# Altium project Gas_Sampler.PrjPcb (part 1 of 3)
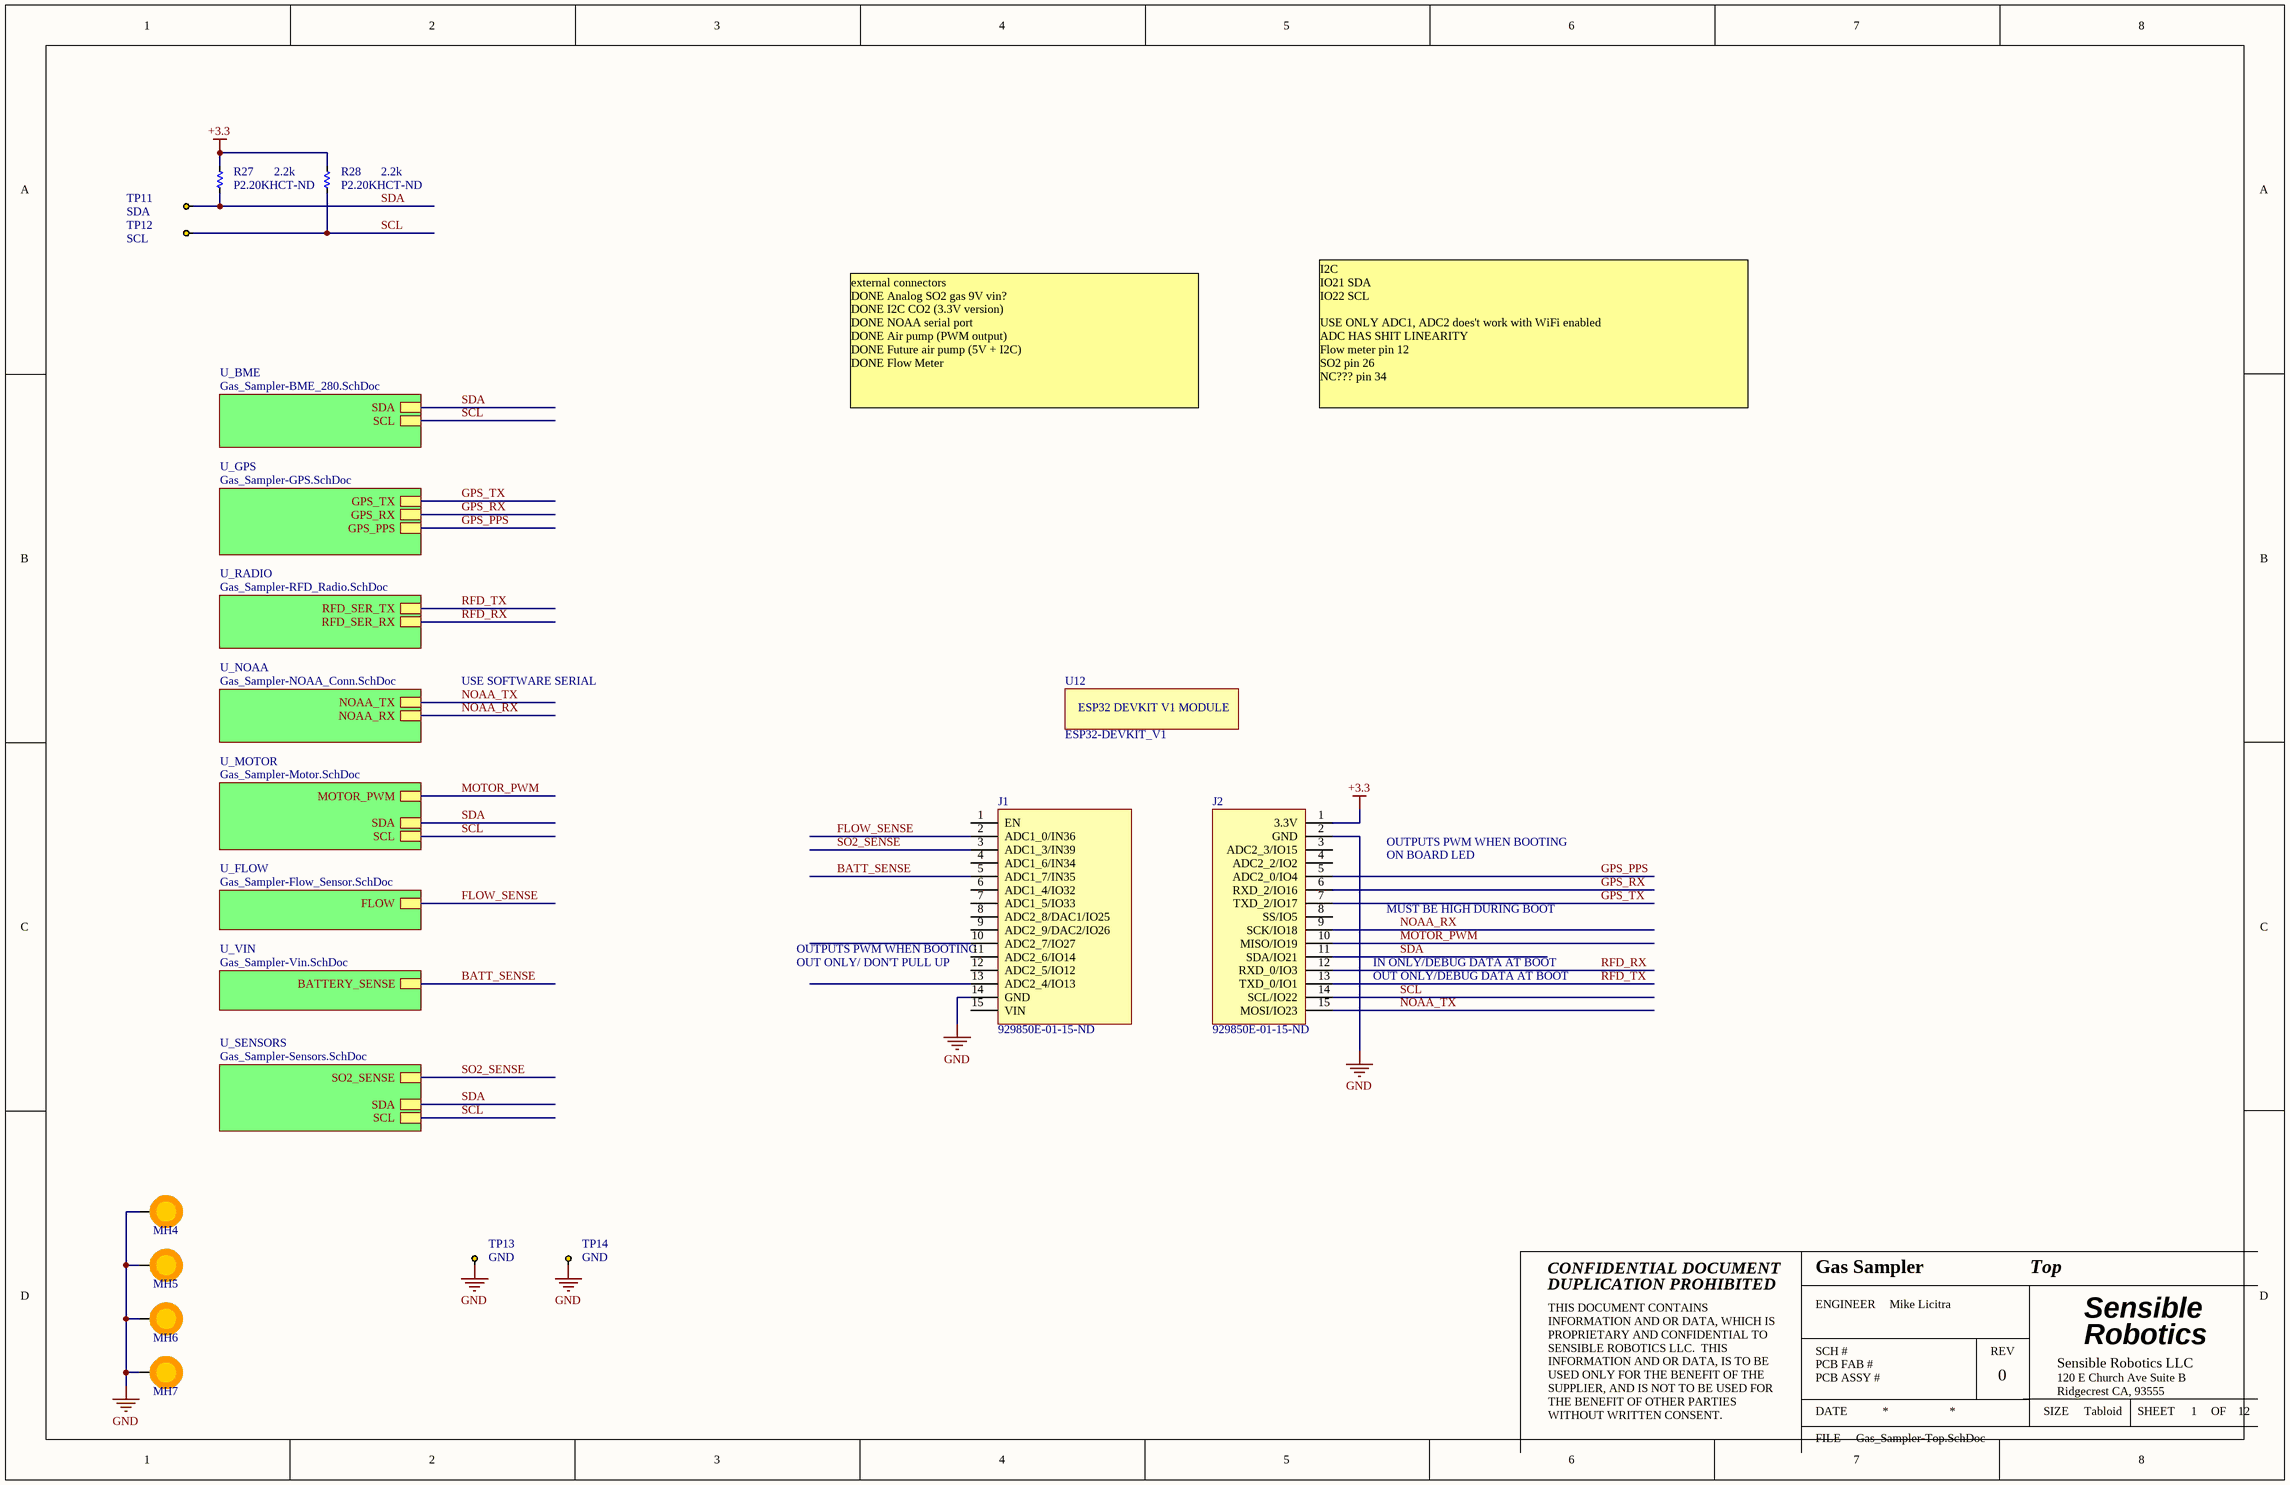
[diagram p0: Gas_Sampler-Top.SchDoc]
PCBRevision: 0; PCBName: Gas Sampler
12 sheets, 130 parts. Net scope: hierarchical (ports join the sheet entries above them; power ports are global).
Board file: Gas_Sampler-PCB.PcbDoc
Sheets:
  Gas_Sampler-Top.SchDoc
    U_RADIO = Gas_Sampler-RFD_Radio.SchDoc
    U_BME = Gas_Sampler-BME_280.SchDoc
    U_GPS = Gas_Sampler-GPS.SchDoc
    U_NOAA = Gas_Sampler-NOAA_Conn.SchDoc
    U_MOTOR = Gas_Sampler-Motor.SchDoc
    U_FLOW = Gas_Sampler-Flow_Sensor.SchDoc
    U_VIN = Gas_Sampler-Vin.SchDoc
      U_5V = Gas_Sampler-5V_Buck.SchDoc
      U_3V = Gas_Sampler-3.3V_LDO.SchDoc
    U_SENSORS = Gas_Sampler-Sensors.SchDoc
      U-9VBOOST = Gas_Sampler-9V_Boost.SchDoc

## Sheet Gas_Sampler-Top.SchDoc: Top
size Tabloid; Organization: Sensible Robotics LLC; Address1: 120 E Church Ave Suite B; Address2: Ridgecrest CA, 93555; Revision: 0; SheetNumber: 1; SheetTotal: 12; ApprovedBy: Approved Name; Engineer: Mike Licitra; PageSetup: Record=PageOptions|CenterHorizontal=True|CenterVertical=True|PrintScale=0.98|XCorrection=1.00|YCorrection=1.00|PrintKind=0|BorderSize=5000000|LeftOffset=0|BottomOffset=0|Orientation=2|PaperLength=1000|PaperWidth=1000|Scale=100|PaperSource=15|PrintQuality=600|MediaType=1|DitherType=10|PaperKind=Tabloid|PrintScaleMode=1

### Parts
J1  Supplier Part Number 1: 929850E-01-15-ND  [SOCKET_1X15_POS_0.1_INCH]  (hidden comment: ESP32-DEVKIT_V1-30PIN_MODULE_J2)
J2  Supplier Part Number 1: 929850E-01-15-ND  [SOCKET_1X15_POS_0.1_INCH]  (hidden comment: ESP32-DEVKIT_V1-30PIN_MODULE_J3)
MH4  SCREW  [SCREW_M3]  (value not drawn)  (no BOM)
MH5  SCREW  [SCREW_M3]  (value not drawn)  (no BOM)
MH6  SCREW  [SCREW_M3]  (value not drawn)  (no BOM)
MH7  SCREW  [SCREW_M3]  (value not drawn)  (no BOM)
R27  value 2.2k  Supplier Part Number 1: P2.20KHCT-ND  [R0603]  (hidden comment: RES_0603_2.2K_OHM_1/10W_1%)
R28  value 2.2k  Supplier Part Number 1: P2.20KHCT-ND  [R0603]  (hidden comment: RES_0603_2.2K_OHM_1/10W_1%)
TP11  SDA  [TP_KEYSTONE_5001]
TP12  SCL  [TP_KEYSTONE_5001]
TP13  GND  [TP_KEYSTONE_5001]
TP14  GND  [TP_KEYSTONE_5001]
U12  ESP32-DEVKIT_V1  [ESP32_DEVKITV1_MODULE]

### Sub-sheets
U_BME = Gas_Sampler-BME_280.SchDoc: SDA, SCL
U_FLOW = Gas_Sampler-Flow_Sensor.SchDoc: FLOW
U_GPS = Gas_Sampler-GPS.SchDoc: GPS_PPS, GPS_TX, GPS_RX
U_MOTOR = Gas_Sampler-Motor.SchDoc: MOTOR_PWM, SDA, SCL
U_NOAA = Gas_Sampler-NOAA_Conn.SchDoc: NOAA_RX, NOAA_TX
U_RADIO = Gas_Sampler-RFD_Radio.SchDoc: RFD_SER_TX, RFD_SER_RX
U_SENSORS = Gas_Sampler-Sensors.SchDoc: SDA, SCL, SO2_SENSE
U_VIN = Gas_Sampler-Vin.SchDoc: BATTERY_SENSE

### Nets
+3.3: J2.1(3.3V) R27.2 R28.2
GND: J1.14(GND) J2.2(GND) MH4.1 MH5.1 MH6.1 MH7.1 TP13.1 TP14.1
BATT_SENSE: J1.5(ADC1_7/IN35) ; sheet U_VIN/BATTERY_SENSE
FLOW_SENSE: J1.2(ADC1_0/IN36) ; sheet U_FLOW/FLOW
GPS_PPS: J2.5(ADC2_0/IO4) ; sheet U_GPS/GPS_PPS
GPS_RX: J2.6(RXD_2/IO16) ; sheet U_GPS/GPS_RX
GPS_TX: J2.7(TXD_2/IO17) ; sheet U_GPS/GPS_TX
MOTOR_PWM: J2.10(MISO/IO19) ; sheet U_MOTOR/MOTOR_PWM
NOAA_RX: J2.9(SCK/IO18) ; sheet U_NOAA/NOAA_RX
NOAA_TX: J2.15(MOSI/IO23) ; sheet U_NOAA/NOAA_TX
RFD_RX: J2.12(RXD_0/IO3) ; sheet U_RADIO/RFD_SER_RX
RFD_TX: J2.13(TXD_0/IO1) ; sheet U_RADIO/RFD_SER_TX
SCL: J2.14(SCL/IO22) R28.1 TP12.1 ; sheet U_BME/SCL, sheet U_MOTOR/SCL, sheet U_SENSORS/SCL
SDA: J2.11(SDA/IO21) R27.1 TP11.1 ; sheet U_BME/SDA, sheet U_MOTOR/SDA, sheet U_SENSORS/SDA
SO2_SENSE: J1.3(ADC1_3/IN39) ; sheet U_SENSORS/SO2_SENSE

Not connected (* = marked no-connect by the designer): J1 1(EN) 4(ADC1_6/IN34) 6(ADC1_4/IO32) 7(ADC1_5/IO33) 8(ADC2_8/DAC1/IO25) 9(ADC2_9/DAC2/IO26) 10(ADC2_7/IO27) 11(ADC2_6/IO14) 12(ADC2_5/IO12) 13(ADC2_4/IO13) 15(VIN); J2 3(ADC2_3/IO15) 4(ADC2_2/IO2) 8(SS/IO5)

### Notes on the sheet
- external connectors
  DONE Analog SO2 gas 9V vin?
  DONE I2C CO2 (3.3V version)
  DONE NOAA serial port
  DONE Air pump (PWM output)
  DONE Future air pump (5V + I2C)
  DONE Flow Meter
- I2C
  IO21 SDA
  IO22 SCL
  USE ONLY ADC1, ADC2 does't work with WiFi enabled
  ADC HAS SHIT LINEARITY
  Flow meter pin 12
  SO2 pin 26
  NC??? pin 34
- USE SOFTWARE SERIAL
- ON BOARD LED
- OUTPUTS PWM WHEN BOOTING
- OUT ONLY/ DON'T PULL UP
- IN ONLY/DEBUG DATA AT BOOT
- MUST BE HIGH DURING BOOT
- OUT ONLY/DEBUG DATA AT BOOT
- CONFIDENTIAL DOCUMENT
- DUPLICATION PROHIBITED
- ENGINEER
- PCB FAB #
- SCH #
- REV
- Sensible
- Robotics
- THIS DOCUMENT CONTAINS INFORMATION AND OR DATA, WHICH IS PROPRIETARY AND CONFIDENTIAL TO SENSIBLE ROBOTICS LLC.  THIS INFORMATION AND OR DATA, IS TO BE USED ONLY FOR THE BENEFIT OF THE SUPPLIER, AND IS NOT TO BE USED FOR THE BENEFIT OF OTHER PARTIES WITHOUT WRITTEN CONSENT.
- DATE
- PCB ASSY #
- SIZE
- Tabloid
- SHEET
- OF
- FILE
- (in symbol ESP32-DEVKIT_V1) ESP32 DEVKIT V1 MODULE

### Library data of the parts
J1 = ESP32-DEVKIT_V1-30PIN_MODULE_J2: CONN_SOCKETS_1X15_POS_0.1_INCH; Manufacturer: 3M; Manufacturer Part Number: 929850-01-15-RA; Connector Type: Receptacle; Number of Positions: 19; Number of Positions Loaded: All; Pitch: 0.100" (2.54mm); Supplier 1: Digi-Key; Packaging: Bulk; Contact Type: Forked; Number of Rows: 1; Mounting Type: Through Hole; Termination: Solder; Contact Finish: Gold; Contact Finish Thickness: 10µin (0.25µm); ComponentLink1URL: http://multimedia.3m.com/mws/mediawebserver?66666UuZjcFSLXTt4Xf_LXs6EVuQEcuZgVs6EVs6E666666--; ComponentLink1Description: http://multimedia.3m.com/mws/mediawebserver?66666UuZjcFSLXTt4Xf_LXs6EVuQEcuZgVs6EVs6E666666--
J2 = ESP32-DEVKIT_V1-30PIN_MODULE_J3: CONN_SOCKETS_1X15_POS_0.1_INCH; Manufacturer: 3M; Manufacturer Part Number: 929850-01-15-RA; Connector Type: Receptacle; Number of Positions: 19; Number of Positions Loaded: All; Pitch: 0.100" (2.54mm); Supplier 1: Digi-Key; Packaging: Bulk; Contact Type: Forked; Number of Rows: 1; Mounting Type: Through Hole; Termination: Solder; Contact Finish: Gold; Contact Finish Thickness: 10µin (0.25µm); ComponentLink1URL: http://multimedia.3m.com/mws/mediawebserver?66666UuZjcFSLXTt4Xf_LXs6EVuQEcuZgVs6EVs6E666666--; ComponentLink1Description: http://multimedia.3m.com/mws/mediawebserver?66666UuZjcFSLXTt4Xf_LXs6EVuQEcuZgVs6EVs6E666666--
R27 R28 = RES_0603_2.2K_OHM_1/10W_1%: RES 2.2K OHM 1/10W 1% 0603 SMD; Manufacturer: Panasonic Electronic Components; Manufacturer Part Number: ERJ-3EKF2201V; Part Number: 470-00097-00; Power (Watts): 0.1W, 1/10W; Temperature Coefficient: ±100ppm/°C; Supplier 1: Digi-Key; RoHS: RoHS Compliant; Category: Resistors; Stock 1: 242061; Pricing 1: 1=0.1, 50=0.0138, 100=0.0105, 250=0.0078, 500=0.00576, 1000=0.00384 (USD); Packaging: Cut Tape (CT); Composition: Thick Film; Features: -; Tolerance: ±1%; Package / Case: 0603 (1608 Metric); Supplier Device Package: 0603; Size / Dimension: 0.063" L x 0.031" W (1.60mm x 0.80mm); Height: 0.022" (0.55mm); Number of Terminations: 2; ComponentLink1URL: http://industrial.panasonic.com/www-cgi/jvcr13pz.cgi?E+PZ+3+AOA0002+ERJ3EKF2201V+7+WW; ComponentLink1Description: http://industrial.panasonic.com/www-cgi/jvcr13pz.cgi?E+PZ+3+AOA0002+ERJ3EKF2201V+7+WW
TP11-TP14 = TEST_KEYSTONE5001: PC TEST POINT TH RING; Manufacturer: Keystone Electronics; Manufacturer Part Number: 5001; Part Number: 250-00184-00; Supplier 1: Digi-Key; Supplier Part Number 1: 5001K-ND; RoHS: RoHS Compliant; Category: Test and Measurement; Stock 1: 341830; Pricing 1: 1=0.33, 10=0.309, 50=0.2252, 100=0.2164, 250=0.19432, 500=0.18548, 1000=0.15456, 2500=0.14131, 5000=0.13248 (USD); Packaging: Bulk; Type: PC Test Point, Miniature; Terminal: 0.010" x 0.020" (0.25mm x 0.51mm) Phosphor Bronze Wire, Silver Plate; Mounting Type: 0.040" (1.02mm) Hole Diameter; Material: Base, Nylon 46, UL 94V-0; Color: Black; ComponentLink1URL: http://www.keyelco.com/product-pdf.cfm?p=1310; ComponentLink1Description: http://www.keyelco.com/product-pdf.cfm?p=1310
U12 = ESP32-DEVKIT_V1: ESP32-DEVKIT V1 MODULE; Supplier 1: Digi-Key

## Sheet Gas_Sampler-RFD_Radio.SchDoc: Radio
size Tabloid; Organization: Sensible Robotics LLC; Address1: 120 E Church Ave Suite B; Address2: Ridgecrest CA, 93555; Revision: 0; SheetNumber: 2; SheetTotal: 12; ApprovedBy: Approved Name; Engineer: Mike Licitra; PageSetup: Record=PageOptions|CenterHorizontal=True|CenterVertical=True|PrintScale=0.98|XCorrection=1.00|YCorrection=1.00|PrintKind=0|BorderSize=5000000|LeftOffset=0|BottomOffset=0|Orientation=2|PaperLength=1000|PaperWidth=1000|Scale=100|PaperSource=15|PrintQuality=600|MediaType=1|DitherType=10|PaperKind=Tabloid|PrintScaleMode=1
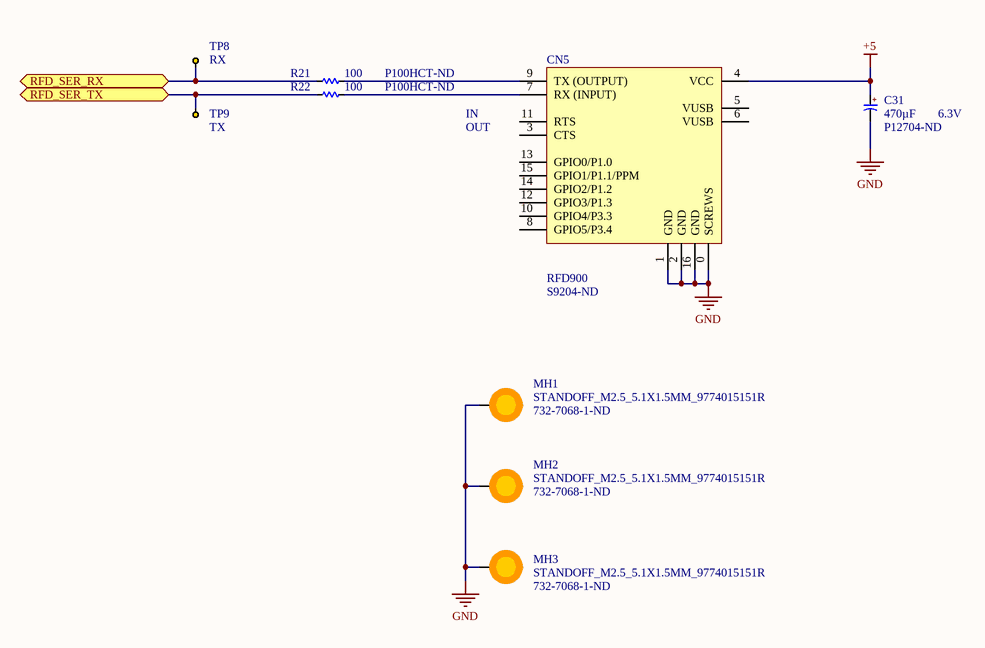
[diagram p1: Gas_Sampler-RFD_Radio.SchDoc]

### Parts
C31  value 470µF  Voltage - Rated: 6.3V  Supplier Part Number 1: P12704-ND  [CAP_RADIAL_8MM_DIA_11.5MM_LEN_3.5MM_LEADSPACE]  (hidden comment: CAP_ALUM_470UF_6.3V_20%_RADIAL_8X11.5MM)
CN5  RFD900  Supplier Part Number 1: S9204-ND  [RFD900_FLAT]
MH1  STANDOFF_M2.5_5.1X1.5MM_9774015151R  Supplier Part Number 1: 732-7068-1-ND  [STANDOFF_M2.5_5.1X1.5MM]
MH2  STANDOFF_M2.5_5.1X1.5MM_9774015151R  Supplier Part Number 1: 732-7068-1-ND  [STANDOFF_M2.5_5.1X1.5MM]
MH3  STANDOFF_M2.5_5.1X1.5MM_9774015151R  Supplier Part Number 1: 732-7068-1-ND  [STANDOFF_M2.5_5.1X1.5MM]
R21  value 100  Supplier Part Number 1: P100HCT-ND  [R0603]  (hidden comment: RES_0603_100_OHM_1/10W_1%)
R22  value 100  Supplier Part Number 1: P100HCT-ND  [R0603]  (hidden comment: RES_0603_100_OHM_1/10W_1%)
TP8  RX  [TP_KEYSTONE_5001]
TP9  TX  [TP_KEYSTONE_5001]

### Ports
RFD_SER_RX, RFD_SER_TX

### Nets
+5: C31.1 CN5.4(VCC)
GND: C31.2 CN5.0(SCREWS) CN5.1(GND) CN5.2(GND) CN5.16(GND) MH1.1 MH2.1 MH3.1
RFD_RX: R21.1 TP8.1 ; port RFD_SER_RX
RFD_TX: R22.1 TP9.1 ; port RFD_SER_TX
NetCN5_7: CN5.7(RX_(INPUT)) R22.2
NetCN5_9: CN5.9(TX_(OUTPUT)) R21.2

Not connected (* = marked no-connect by the designer): CN5 3(CTS) 5(VUSB) 6(VUSB) 8(GPIO5/P3.4) 10(GPIO4/P3.3) 11(RTS) 12(GPIO3/P1.3) 13(GPIO0/P1.0) 14(GPIO2/P1.2) 15(GPIO1/P1.1/PPM)

### Notes on the sheet
- IN
- OUT
- CONFIDENTIAL DOCUMENT
- DUPLICATION PROHIBITED
- ENGINEER
- PCB FAB #
- SCH #
- REV
- Sensible
- Robotics
- THIS DOCUMENT CONTAINS INFORMATION AND OR DATA, WHICH IS PROPRIETARY AND CONFIDENTIAL TO SENSIBLE ROBOTICS LLC.  THIS INFORMATION AND OR DATA, IS TO BE USED ONLY FOR THE BENEFIT OF THE SUPPLIER, AND IS NOT TO BE USED FOR THE BENEFIT OF OTHER PARTIES WITHOUT WRITTEN CONSENT.
- DATE
- PCB ASSY #
- SIZE
- Tabloid
- SHEET
- OF
- FILE
- (in symbol CAP_ALUM_470UF_6.3V_20%_RADIAL_8X11.5MM) +

### Library data of the parts
C31 = CAP_ALUM_470UF_6.3V_20%_RADIAL_8X11.5MM: CAP ALUM 470UF 6.3V 20% RADIAL; Manufacturer: Panasonic Electronic Components; Manufacturer Part Number: EEU-FC0J471; Lifetime @ Temp.: 2000 Hrs @ 105°C; Ripple Current: 555mA; Impedance: 117 mOhm; Supplier 1: Digi-Key; RoHS: RoHS Compliant; Category: Capacitors; Stock 1: 89301; Pricing 1: 1=0.48, 50=0.2352, 100=0.2016, 500=0.1512, 1000=0.12768, 5000=0.11424, 10000=0.10752, 25000=0.1008 (USD); Packaging: Bulk; Tolerance: ±20%; Operating Temperature: -55°C ~ 105°C; Features: General Purpose; ESR (Equivalent Series Resistance): -; Mounting Type: Through Hole; Package / Case: Radial, Can; Size / Dimension: 0.315" Dia (8.00mm); Height - Seated (Max): 0.453" (11.50mm); Lead Spacing: 0.138" (3.50mm); ComponentLink1URL: http://industrial.panasonic.com/www-cgi/jvcr13pz.cgi?E+PZ+3+ABA0022+EEUFC0J471+7+WW; ComponentLink1Description: http://industrial.panasonic.com/www-cgi/jvcr13pz.cgi?E+PZ+3+ABA0022+EEUFC0J471+7+WW
CN5 = RFD900: Manufacturer Part Number: SFH11-PBPC-D08-RA-BK; Manufacturer: Sullins Connector Solutions; Supplier 1: Digikey
MH1-MH3 = STANDOFF_M2.5_5.1X1.5MM_9774015151R: RND STNDFF M2.5X0.45 STEEL 1.5MM; Manufacturer: Wurth Electronics Inc.; Manufacturer Part Number: 9774015151R; Supplier 1: Digikey
R21 R22 = RES_0603_100_OHM_1/10W_1%: RES 100 OHM 1/10W 1% 0603 SMD; Manufacturer: Panasonic Electronic Components; Manufacturer Part Number: ERJ-3EKF1000V; Part Number: 470-00121-00; Power (Watts): 0.1W, 1/10W; Temperature Coefficient: ±100ppm/°C; Supplier 1: Digi-Key; RoHS: RoHS Compliant; Category: Resistors; Stock 1: 1025169; Pricing 1: 1=0.1, 50=0.0138, 100=0.0105, 250=0.0078, 500=0.00576, 1000=0.00384 (USD); Packaging: Cut Tape (CT); Composition: Thick Film; Features: -; Tolerance: ±1%; Package / Case: 0603 (1608 Metric); Supplier Device Package: 0603; Size / Dimension: 0.063" L x 0.031" W (1.60mm x 0.80mm); Height: 0.022" (0.55mm); Number of Terminations: 2; ComponentLink1URL: http://industrial.panasonic.com/www-cgi/jvcr13pz.cgi?E+PZ+3+AOA0002+ERJ3EKF1000V+7+WW; ComponentLink1Description: http://industrial.panasonic.com/www-cgi/jvcr13pz.cgi?E+PZ+3+AOA0002+ERJ3EKF1000V+7+WW
TP8 TP9 = TEST_KEYSTONE5001: as TP11 on sheet Gas_Sampler-Top; Supplier 1: Digi-Key; Supplier Part Number 1: 5001K-ND; RoHS: RoHS Compliant; Category: Test and Measurement; Stock 1: 341830; Pricing 1: 1=0.33, 10=0.309, 50=0.2252, 100=0.2164, 250=0.19432, 500=0.18548, 1000=0.15456, 2500=0.14131, 5000=0.13248 (USD); Packaging: Bulk; Type: PC Test Point, Miniature; Terminal: 0.010" x 0.020" (0.25mm x 0.51mm) Phosphor Bronze Wire, Silver Plate; Mounting Type: 0.040" (1.02mm) Hole Diameter; Material: Base, Nylon 46, UL 94V-0; Color: Black; ComponentLink1URL: http://www.keyelco.com/product-pdf.cfm?p=1310; ComponentLink1Description: http://www.keyelco.com/product-pdf.cfm?p=1310

## Sheet Gas_Sampler-BME_280.SchDoc: BME 280
size Tabloid; Organization: Sensible Robotics LLC; Address1: 120 E Church Ave Suite B; Address2: Ridgecrest CA, 93555; Revision: 0; SheetNumber: 7; SheetTotal: 12; ApprovedBy: Approved Name; Engineer: Mike Licitra; PageSetup: Record=PageOptions|CenterHorizontal=True|CenterVertical=True|PrintScale=0.98|XCorrection=1.00|YCorrection=1.00|PrintKind=0|BorderSize=5000000|LeftOffset=0|BottomOffset=0|Orientation=2|PaperLength=1000|PaperWidth=1000|Scale=100|PaperSource=15|PrintQuality=600|MediaType=1|DitherType=10|PaperKind=Tabloid|PrintScaleMode=1
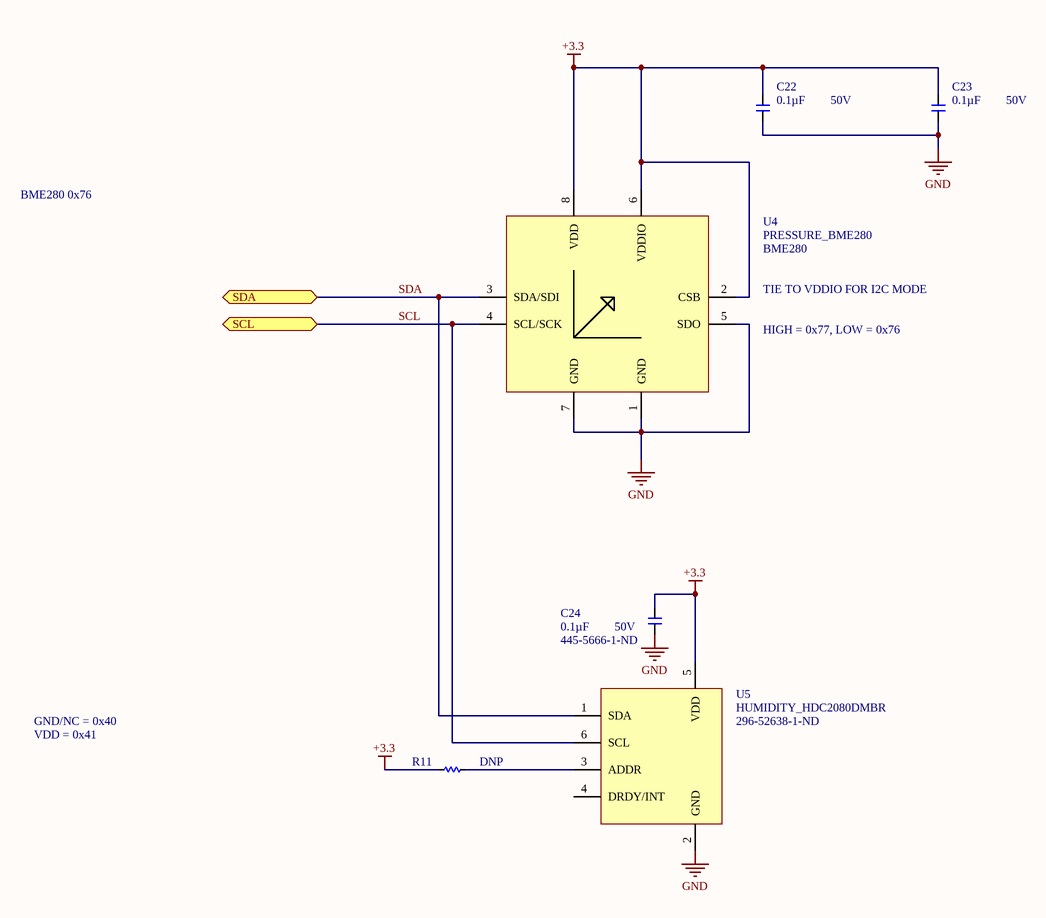
[diagram p2: Gas_Sampler-BME_280.SchDoc]

### Parts
C22  value 0.1µF  Voltage - Rated: 50V  [C0603]  (hidden comment: CAP_CER_0603_0.1UF_50V_10%_X7R)
C23  value 0.1µF  Voltage - Rated: 50V  [C0603]  (hidden comment: CAP_CER_0603_0.1UF_50V_10%_X7R)
C24  value 0.1µF  Voltage - Rated: 50V  Supplier Part Number 1: 445-5666-1-ND  [C0603]  (hidden comment: CAP_CER_0603_0.1UF_50V_10%_X7R)
R11  value DNP  [R0603]  (hidden comment: RES_0603_DNP)  (no BOM)
U4  PRESSURE_BME280  Manufacturer Part Number: BME280  [BOSCH_BME280]
U5  HUMIDITY_HDC2080DMBR  Supplier Part Number 1: 296-52638-1-ND  [6DFN3X3_NO_EP]

### Ports
SCL, SDA

### Nets
+3.3: C22.1 C23.1 C24.1 R11.1 U4.2(CSB) U4.6(VDDIO) U4.8(VDD) U5.5(VDD)
GND: C22.2 C23.2 C24.2 U4.1(GND) U4.5(SDO) U4.7(GND) U5.2(GND)
SCL: U4.4(SCL/SCK) U5.6(SCL) ; port SCL
SDA: U4.3(SDA/SDI) U5.1(SDA) ; port SDA
NetR11_2: R11.2 U5.3(ADDR)

Not connected (* = marked no-connect by the designer): U5 4(DRDY/INT)

### Notes on the sheet
- BME280 0x76
- TIE TO VDDIO FOR I2C MODE
- HIGH = 0x77, LOW = 0x76
- GND/NC = 0x40
- VDD = 0x41
- CONFIDENTIAL DOCUMENT
- DUPLICATION PROHIBITED
- ENGINEER
- PCB FAB #
- SCH #
- REV
- Sensible
- Robotics
- THIS DOCUMENT CONTAINS INFORMATION AND OR DATA, WHICH IS PROPRIETARY AND CONFIDENTIAL TO SENSIBLE ROBOTICS LLC.  THIS INFORMATION AND OR DATA, IS TO BE USED ONLY FOR THE BENEFIT OF THE SUPPLIER, AND IS NOT TO BE USED FOR THE BENEFIT OF OTHER PARTIES WITHOUT WRITTEN CONSENT.
- DATE
- PCB ASSY #
- SIZE
- Tabloid
- SHEET
- OF
- FILE

### Library data of the parts
C22-C24 = CAP_CER_0603_0.1UF_50V_10%_X7R: CAP CER 0.1UF 50V 10% X7R 0603; Manufacturer: TDK Corporation; Manufacturer Part Number: CGA3E2X7R1H104K080AA; Supplier 1: Digi-Key; RoHS: RoHS Compliant; Category: Capacitors; Stock 1: 320000; Pricing 1: 1=0.1, 10=0.072, 100=0.033, 250=0.027, 500=0.0231, 1000=0.018 (USD); Packaging: Cut Tape (CT); Tolerance: ±10%; Temperature Coefficient: X7R; Mounting Type: Surface Mount, MLCC; Operating Temperature: -55°C ~ 125°C; Applications: Automotive; Ratings: AEC-Q200; Package / Case: 0603 (1608 Metric); Size / Dimension: 0.063" L x 0.031" W (1.60mm x 0.80mm); Height - Seated (Max): -; Thickness (Max): 0.035" (0.90mm); Lead Spacing: -; Features: -; Lead Style: -; ComponentLink1URL: http://product.tdk.com/capacitor/mlcc/en/documents/mlcc_automotive_general_en.pdf; ComponentLink1Description: http://product.tdk.com/capacitor/mlcc/en/documents/mlcc_automotive_general_en.pdf
  C22 C23: Supplier Part Number 1: 445-5666-1-ND
R11 = RES_0603_DNP: RES DNP 0603 SMD; Part Number: 000-00000-00; Supplier 1: Digi-Key; Supplier Part Number 1: DNP
U4 = PRESSURE_BME280: SENSOR PRESSURE HUMIDITY TEMP; Manufacturer: Bosch Sensortec; Sensor Type: Humidity, Pressure, Temperature; Humidity Range: 0 ~ 100% RH; Output Type: I²C, SPI; Output: 16b; Accuracy: ±3%; Voltage - Supply: 1.71 V ~ 3.6 V; Supplier 1: Digi-Key; RoHS: RoHS Compliant; Category: Sensors, Transducers; Stock 1: 45909; Pricing 1: 1=7.56, 5=6.628, 10=5.965, 25=5.302, 50=4.9044, 100=4.2416, 500=3.9765, 1000=3.7114 (USD); Packaging: Cut Tape (CT); Part Status: Active; Mounting Type: Surface Mount; Operating Temperature: -40°C ~ 85°C; Package / Case: 8-VFLGA; Supplier Device Package: 8-LGA (2.5x2.5); ComponentLink1URL: https://ae-bst.resource.bosch.com/media/_tech/media/datasheets/BST-BME280_DS001-12.pdf; ComponentLink1Description: https://ae-bst.resource.bosch.com/media/_tech/media/datasheets/BST-BME280_DS001-12.pdf; Supplier Part Number 1: 828-1063-1-ND
U5 = HUMIDITY_HDC2080DMBR: Humidity Temperature Sensor 0 ~ 100% RH I²C ±2% RH Surface Mount; Manufacturer: Texas Instruments; Accuracy: ±2% RH; Voltage - Supply: 1.62V ~ 3.6V; Response Time: 8s; Supplier 1: Digi-Key; Manufacturer Part Number: HDC2080DMBR; Packaging: Cut Tape (CT); Operating Temperature: -40°C ~ 85°C; Package / Case: 6-WDFN Exposed Pad; Supplier Device Package: 6-WSON (3x3); ComponentLink1URL: http://www.ti.com/general/docs/suppproductinfo.tsp?distId=10&gotoUrl=http%3A%2F%2Fwww.ti.com%2Flit%2Fgpn%2Fhdc2080; ComponentLink1Description: http://www.ti.com/general/docs/suppproductinfo.tsp?distId=10&gotoUrl=http%3A%2F%2Fwww.ti.com%2Flit%2Fgpn%2Fhdc2080; Humidity Range: 0 ~ 100% RH

## Sheet Gas_Sampler-GPS.SchDoc: GPS
size Tabloid; Organization: Sensible Robotics LLC; Address1: 120 E Church Ave Suite B; Address2: Ridgecrest CA, 93555; Revision: 0; SheetNumber: 8; SheetTotal: 12; ApprovedBy: Approved Name; Engineer: Mike Licitra; PageSetup: Record=PageOptions|CenterHorizontal=True|CenterVertical=True|PrintScale=0.98|XCorrection=1.00|YCorrection=1.00|PrintKind=0|BorderSize=5000000|LeftOffset=0|BottomOffset=0|Orientation=2|PaperLength=1000|PaperWidth=1000|Scale=100|PaperSource=15|PrintQuality=600|MediaType=1|DitherType=10|PaperKind=Tabloid|PrintScaleMode=1
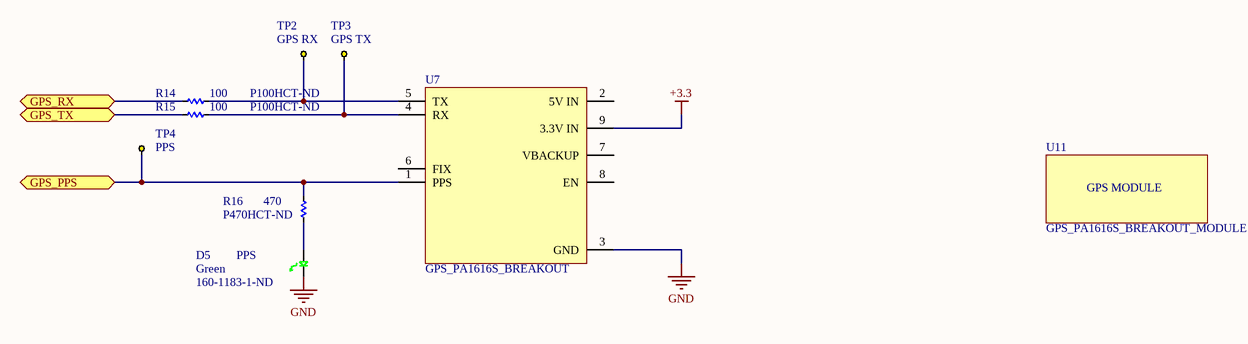
[diagram p3: Gas_Sampler-GPS.SchDoc]

### Parts
D5  PPS  Color: Green  Supplier Part Number 1: 160-1183-1-ND  [LED_0603_GREEN]
R14  value 100  Supplier Part Number 1: P100HCT-ND  [R0603]  (hidden comment: RES_0603_100_OHM_1/10W_1%)
R15  value 100  Supplier Part Number 1: P100HCT-ND  [R0603]  (hidden comment: RES_0603_100_OHM_1/10W_1%)
R16  value 470  Supplier Part Number 1: P470HCT-ND  [R0603]  (hidden comment: RES_0603_470_OHM_1/10W_1%)
TP2  GPS RX  [TP_KEYSTONE_5001]
TP3  GPS TX  [TP_KEYSTONE_5001]
TP4  PPS  [TP_KEYSTONE_5001]
U7  GPS_PA1616S_BREAKOUT  [HEADER_1X9_POS_UNSHROUDED]
U11  GPS_PA1616S_BREAKOUT_MODULE  [GPS_PA1616S_BREAKOUT]

### Ports
GPS_PPS, GPS_RX, GPS_TX

### Nets
+3.3: U7.9(3.3V_IN)
GND: D5.2(CATHODE) U7.3(GND)
GPS_PPS: R16.2 TP4.1 U7.1(PPS) ; port GPS_PPS
GPS_RX: R14.1 ; port GPS_RX
GPS_TX: R15.1 ; port GPS_TX
NetD5_1: D5.1(ANODE) R16.1
NetR14_2: R14.2 TP2.1 U7.5(TX)
NetR15_2: R15.2 TP3.1 U7.4(RX)

Not connected (* = marked no-connect by the designer): U7 2(5V_IN) 6(FIX) 7(VBACKUP) 8(EN)

### Notes on the sheet
- CONFIDENTIAL DOCUMENT
- DUPLICATION PROHIBITED
- ENGINEER
- PCB FAB #
- SCH #
- REV
- Sensible
- Robotics
- THIS DOCUMENT CONTAINS INFORMATION AND OR DATA, WHICH IS PROPRIETARY AND CONFIDENTIAL TO SENSIBLE ROBOTICS LLC.  THIS INFORMATION AND OR DATA, IS TO BE USED ONLY FOR THE BENEFIT OF THE SUPPLIER, AND IS NOT TO BE USED FOR THE BENEFIT OF OTHER PARTIES WITHOUT WRITTEN CONSENT.
- DATE
- PCB ASSY #
- SIZE
- Tabloid
- SHEET
- OF
- FILE
- (in symbol GPS_PA1616S_BREAKOUT_MODULE) GPS MODULE

### Library data of the parts
D5 = LED_0603_GREEN_LG_LTST-C190GKT: LED GREEN CLEAR 0603 SMD; Manufacturer: Lite-On Inc; Millicandela Rating: 6mcd; Wavelength - Dominant: 569nm; Wavelength - Peak: 565nm; Viewing Angle: 130°; Lens Style/Size: Rectangle with Flat Top, 1.1mm x 0.8mm; Voltage - Forward (Vf) Typ: 2.1V; Current - Test: 10mA; Supplier 1: Digi-Key; Manufacturer Part Number: LTST-C190GKT; Lens Type: Clear; Package / Case: 0603 (1608 Metric); Size / Dimension: 1.60mm L x 0.80mm W; Height: 0.80mm; Mounting Type: Surface Mount; Packaging: Cut Tape (CT); ComponentLink1URL: http://media.digikey.com/pdf/Data%20Sheets/Lite-On%20PDFs/LTST-C190GKT.pdf; ComponentLink1Description: Datasheet
R14 R15 = RES_0603_100_OHM_1/10W_1%: as R21 on sheet Gas_Sampler-RFD_Radio; Supplier 1: Digi-Key; RoHS: RoHS Compliant; Category: Resistors; Stock 1: 1025169; Pricing 1: 1=0.1, 50=0.0138, 100=0.0105, 250=0.0078, 500=0.00576, 1000=0.00384 (USD); Packaging: Cut Tape (CT); Composition: Thick Film; Features: -; Tolerance: ±1%; Package / Case: 0603 (1608 Metric); Supplier Device Package: 0603; Size / Dimension: 0.063" L x 0.031" W (1.60mm x 0.80mm); Height: 0.022" (0.55mm); Number of Terminations: 2; ComponentLink1URL: http://industrial.panasonic.com/www-cgi/jvcr13pz.cgi?E+PZ+3+AOA0002+ERJ3EKF1000V+7+WW; ComponentLink1Description: http://industrial.panasonic.com/www-cgi/jvcr13pz.cgi?E+PZ+3+AOA0002+ERJ3EKF1000V+7+WW
R16 = RES_0603_470_OHM_1/10W_1%: RES 470 OHM 1/10W 1% 0603 SMD; Manufacturer: Panasonic Electronic Components; Manufacturer Part Number: ERJ-3EKF4700V; Part Number: 470-00157-00; Power (Watts): 0.1W, 1/10W; Temperature Coefficient: ±100ppm/°C; Supplier 1: Digi-Key; RoHS: RoHS Compliant; Category: Resistors; Stock 1: 212428; Pricing 1: 1=0.1, 50=0.0138, 100=0.0105, 250=0.0078, 500=0.00576, 1000=0.00384 (USD); Packaging: Cut Tape (CT); Composition: Thick Film; Features: -; Tolerance: ±1%; Package / Case: 0603 (1608 Metric); Supplier Device Package: 0603; Size / Dimension: 0.063" L x 0.031" W (1.60mm x 0.80mm); Height: 0.022" (0.55mm); Number of Terminations: 2; ComponentLink1URL: http://industrial.panasonic.com/www-cgi/jvcr13pz.cgi?E+PZ+3+AOA0002+ERJ3EKF4700V+7+WW; ComponentLink1Description: http://industrial.panasonic.com/www-cgi/jvcr13pz.cgi?E+PZ+3+AOA0002+ERJ3EKF4700V+7+WW
TP2-TP4 = TEST_KEYSTONE5001: as TP11 on sheet Gas_Sampler-Top; Supplier 1: Digi-Key; Supplier Part Number 1: 5001K-ND; RoHS: RoHS Compliant; Category: Test and Measurement; Stock 1: 341830; Pricing 1: 1=0.33, 10=0.309, 50=0.2252, 100=0.2164, 250=0.19432, 500=0.18548, 1000=0.15456, 2500=0.14131, 5000=0.13248 (USD); Packaging: Bulk; Type: PC Test Point, Miniature; Terminal: 0.010" x 0.020" (0.25mm x 0.51mm) Phosphor Bronze Wire, Silver Plate; Mounting Type: 0.040" (1.02mm) Hole Diameter; Material: Base, Nylon 46, UL 94V-0; Color: Black; ComponentLink1URL: http://www.keyelco.com/product-pdf.cfm?p=1310; ComponentLink1Description: http://www.keyelco.com/product-pdf.cfm?p=1310
U7 = GPS_PA1616S_BREAKOUT: Adafruit Ultimate GPS Breakout - 66 channel w/10 Hz updates - PA1616S
U11 = GPS_PA1616S_BREAKOUT_MODULE: Adafruit Ultimate GPS Breakout - 66 channel w/10 Hz updates - PA1616S

## Sheet Gas_Sampler-NOAA_Conn.SchDoc: NOAA Connector
size Tabloid; Organization: Sensible Robotics LLC; Address1: 120 E Church Ave Suite B; Address2: Ridgecrest CA, 93555; Revision: 0; SheetNumber: 10; SheetTotal: 12; ApprovedBy: Approved Name; Engineer: Mike Licitra; PageSetup: Record=PageOptions|CenterHorizontal=True|CenterVertical=True|PrintScale=0.98|XCorrection=1.00|YCorrection=1.00|PrintKind=0|BorderSize=5000000|LeftOffset=0|BottomOffset=0|Orientation=2|PaperLength=1000|PaperWidth=1000|Scale=100|PaperSource=15|PrintQuality=600|MediaType=1|DitherType=10|PaperKind=Tabloid|PrintScaleMode=1
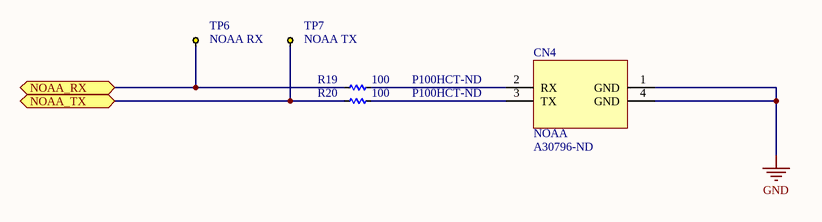
[diagram p4: Gas_Sampler-NOAA_Conn.SchDoc]

### Parts
CN4  NOAA  Supplier Part Number 1: A30796-ND  [TE_3-641216-4]
R19  value 100  Supplier Part Number 1: P100HCT-ND  [R0603]  (hidden comment: RES_0603_100_OHM_1/10W_1%)
R20  value 100  Supplier Part Number 1: P100HCT-ND  [R0603]  (hidden comment: RES_0603_100_OHM_1/10W_1%)
TP6  NOAA RX  [TP_KEYSTONE_5001]
TP7  NOAA TX  [TP_KEYSTONE_5001]

### Ports
NOAA_RX, NOAA_TX

### Nets
GND: CN4.1(GND) CN4.4(GND)
NOAA_RX: R19.1 TP6.1 ; port NOAA_RX
NOAA_TX: R20.1 TP7.1 ; port NOAA_TX
NetCN4_2: CN4.2(RX) R19.2
NetCN4_3: CN4.3(TX) R20.2

### Notes on the sheet
- CONFIDENTIAL DOCUMENT
- DUPLICATION PROHIBITED
- ENGINEER
- PCB FAB #
- SCH #
- REV
- Sensible
- Robotics
- THIS DOCUMENT CONTAINS INFORMATION AND OR DATA, WHICH IS PROPRIETARY AND CONFIDENTIAL TO SENSIBLE ROBOTICS LLC.  THIS INFORMATION AND OR DATA, IS TO BE USED ONLY FOR THE BENEFIT OF THE SUPPLIER, AND IS NOT TO BE USED FOR THE BENEFIT OF OTHER PARTIES WITHOUT WRITTEN CONSENT.
- DATE
- PCB ASSY #
- SIZE
- Tabloid
- SHEET
- OF
- FILE

### Library data of the parts
CN4 = CONN_NOAA_XDATA_RA_3-641216-4: CONN HEADER VERT 4POS 2.54MM; Manufacturer: TE Connectivity AMP Connectors; Number of Positions: 4; Pitch - Mating: 0.100" (2.54mm); Supplier 1: Digi-Key; Manufacturer Part Number: 3-641216-4; Packaging: Bulk; ComponentLink1URL: https://www.te.com/usa-en/product-3-641216-4.datasheet.pdf; ComponentLink1Description: Datasheet; Number of Rows: 1
R19 R20 = RES_0603_100_OHM_1/10W_1%: as R21 on sheet Gas_Sampler-RFD_Radio; Supplier 1: Digi-Key; RoHS: RoHS Compliant; Category: Resistors; Stock 1: 1025169; Pricing 1: 1=0.1, 50=0.0138, 100=0.0105, 250=0.0078, 500=0.00576, 1000=0.00384 (USD); Packaging: Cut Tape (CT); Composition: Thick Film; Features: -; Tolerance: ±1%; Package / Case: 0603 (1608 Metric); Supplier Device Package: 0603; Size / Dimension: 0.063" L x 0.031" W (1.60mm x 0.80mm); Height: 0.022" (0.55mm); Number of Terminations: 2; ComponentLink1URL: http://industrial.panasonic.com/www-cgi/jvcr13pz.cgi?E+PZ+3+AOA0002+ERJ3EKF1000V+7+WW; ComponentLink1Description: http://industrial.panasonic.com/www-cgi/jvcr13pz.cgi?E+PZ+3+AOA0002+ERJ3EKF1000V+7+WW
TP6 TP7 = TEST_KEYSTONE5001: as TP11 on sheet Gas_Sampler-Top; Supplier 1: Digi-Key; Supplier Part Number 1: 5001K-ND; RoHS: RoHS Compliant; Category: Test and Measurement; Stock 1: 341830; Pricing 1: 1=0.33, 10=0.309, 50=0.2252, 100=0.2164, 250=0.19432, 500=0.18548, 1000=0.15456, 2500=0.14131, 5000=0.13248 (USD); Packaging: Bulk; Type: PC Test Point, Miniature; Terminal: 0.010" x 0.020" (0.25mm x 0.51mm) Phosphor Bronze Wire, Silver Plate; Mounting Type: 0.040" (1.02mm) Hole Diameter; Material: Base, Nylon 46, UL 94V-0; Color: Black; ComponentLink1URL: http://www.keyelco.com/product-pdf.cfm?p=1310; ComponentLink1Description: http://www.keyelco.com/product-pdf.cfm?p=1310

## Sheet Gas_Sampler-Motor.SchDoc: Pump Motor
size Tabloid; Organization: Sensible Robotics LLC; Address1: 120 E Church Ave Suite B; Address2: Ridgecrest CA, 93555; Revision: 0; SheetNumber: 11; SheetTotal: 12; ApprovedBy: Approved Name; Engineer: Mike Licitra; PageSetup: Record=PageOptions|CenterHorizontal=True|CenterVertical=True|PrintScale=0.98|XCorrection=1.00|YCorrection=1.00|PrintKind=0|BorderSize=5000000|LeftOffset=0|BottomOffset=0|Orientation=2|PaperLength=1000|PaperWidth=1000|Scale=100|PaperSource=15|PrintQuality=600|MediaType=1|DitherType=10|PaperKind=Tabloid|PrintScaleMode=1
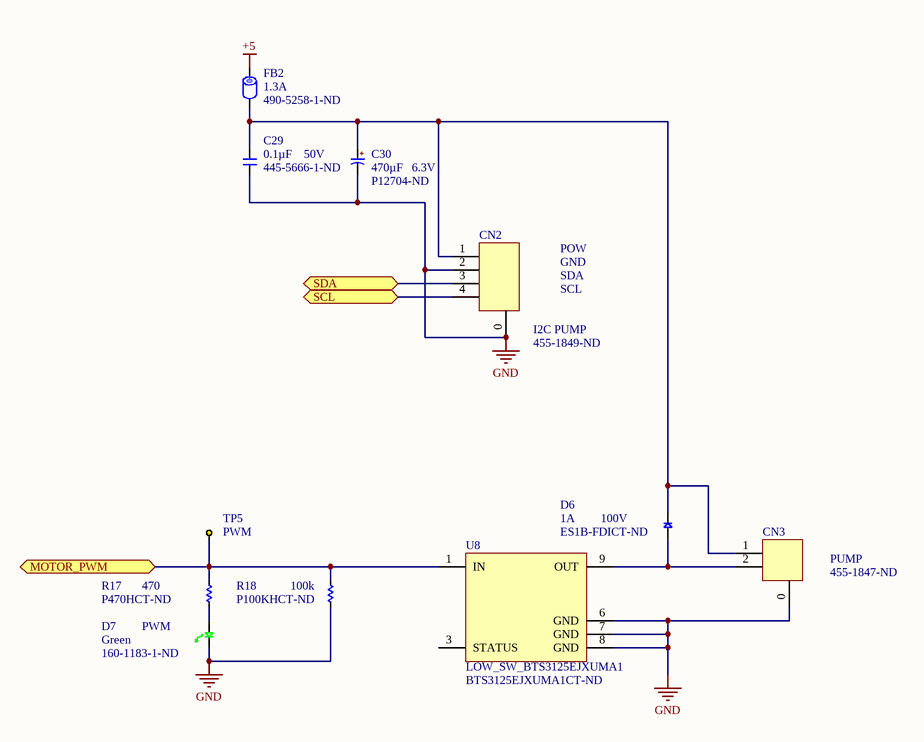
[diagram p5: Gas_Sampler-Motor.SchDoc]

### Parts
C29  value 0.1µF  Voltage - Rated: 50V  Supplier Part Number 1: 445-5666-1-ND  [C0603]  (hidden comment: CAP_CER_0603_0.1UF_50V_10%_X7R)
C30  value 470µF  Voltage - Rated: 6.3V  Supplier Part Number 1: P12704-ND  [CAP_RADIAL_8MM_DIA_11.5MM_LEN_3.5MM_LEADSPACE]  (hidden comment: CAP_ALUM_470UF_6.3V_20%_RADIAL_8X11.5MM)
CN2  I2C PUMP  Supplier Part Number 1: 455-1849-ND  [JST_PA_S04B-PASK-2]
CN3  PUMP  Supplier Part Number 1: 455-1847-ND  [JST_PA_S02B-PASK-2]
D6  Voltage - DC Reverse (Vr) (Max): 100V  Current - Average Rectified (Io): 1A  Supplier Part Number 1: ES1B-FDICT-ND  [SMA]  (hidden comment: DIODE_ES1B-FDICT-ND)
D7  PWM  Color: Green  Supplier Part Number 1: 160-1183-1-ND  [LED_0603_GREEN]
FB2  Current Rating (Max): 1.3A  Supplier Part Number 1: 490-5258-1-ND  [R0603]  (hidden comment: FERRITE_BEAD_0603_1.3A_600_OHM)
R17  value 470  Supplier Part Number 1: P470HCT-ND  [R0603]  (hidden comment: RES_0603_470_OHM_1/10W_1%)
R18  value 100k  Supplier Part Number 1: P100KHCT-ND  [R0603]  (hidden comment: RES_0603_100K_OHM_1/10W_1%)
TP5  PWM  [TP_KEYSTONE_5001]
U8  LOW_SW_BTS3125EJXUMA1  Supplier Part Number 1: BTS3125EJXUMA1CT-ND  [8SOIC150E]

### Ports
MOTOR_PWM, SCL, SDA

### Nets
+5: FB2.1
GND: C29.2 C30.2 CN2.0(CHAS) CN2.2 CN3.0(CHAS) D7.2(CATHODE) R18.1 U8.6(GND) U8.7(GND) U8.8(GND)
MOTOR_PWM: R17.2 R18.2 TP5.1 U8.1(IN) ; port MOTOR_PWM
SCL: CN2.4 ; port SCL
SDA: CN2.3 ; port SDA
NetC29_1: C29.1 C30.1 CN2.1 CN3.1 D6.2 FB2.2
NetCN3_2: CN3.2 D6.1 U8.9(OUT)
NetD7_1: D7.1(ANODE) R17.1

Not connected (* = marked no-connect by the designer): U8 3(STATUS)

### Notes on the sheet
- POW
- GND
- SDA
- SCL
- CONFIDENTIAL DOCUMENT
- DUPLICATION PROHIBITED
- ENGINEER
- PCB FAB #
- SCH #
- REV
- Sensible
- Robotics
- THIS DOCUMENT CONTAINS INFORMATION AND OR DATA, WHICH IS PROPRIETARY AND CONFIDENTIAL TO SENSIBLE ROBOTICS LLC.  THIS INFORMATION AND OR DATA, IS TO BE USED ONLY FOR THE BENEFIT OF THE SUPPLIER, AND IS NOT TO BE USED FOR THE BENEFIT OF OTHER PARTIES WITHOUT WRITTEN CONSENT.
- DATE
- PCB ASSY #
- SIZE
- Tabloid
- SHEET
- OF
- FILE
- (in symbol CAP_ALUM_470UF_6.3V_20%_RADIAL_8X11.5MM) +

### Library data of the parts
C29 = CAP_CER_0603_0.1UF_50V_10%_X7R: CAP CER 0.1UF 50V 10% X7R 0603; Manufacturer: TDK Corporation; Manufacturer Part Number: CGA3E2X7R1H104K080AA; Part Number: 150-00077-00; Supplier 1: Digi-Key; RoHS: RoHS Compliant; Category: Capacitors; Stock 1: 320000; Pricing 1: 1=0.1, 10=0.072, 100=0.033, 250=0.027, 500=0.0231, 1000=0.018 (USD); Packaging: Cut Tape (CT); Tolerance: ±10%; Temperature Coefficient: X7R; Mounting Type: Surface Mount, MLCC; Operating Temperature: -55°C ~ 125°C; Applications: Automotive; Ratings: AEC-Q200; Package / Case: 0603 (1608 Metric); Size / Dimension: 0.063" L x 0.031" W (1.60mm x 0.80mm); Height - Seated (Max): -; Thickness (Max): 0.035" (0.90mm); Lead Spacing: -; Features: -; Lead Style: -; ComponentLink1URL: http://product.tdk.com/capacitor/mlcc/en/documents/mlcc_automotive_general_en.pdf; ComponentLink1Description: http://product.tdk.com/capacitor/mlcc/en/documents/mlcc_automotive_general_en.pdf
C30 = CAP_ALUM_470UF_6.3V_20%_RADIAL_8X11.5MM: CAP ALUM 470UF 6.3V 20% RADIAL; Manufacturer: Panasonic Electronic Components; Manufacturer Part Number: EEU-FC0J471; Part Number: 150-00053-00; Lifetime @ Temp.: 2000 Hrs @ 105°C; Ripple Current: 555mA; Impedance: 117 mOhm; Supplier 1: Digi-Key; RoHS: RoHS Compliant; Category: Capacitors; Stock 1: 89301; Pricing 1: 1=0.48, 50=0.2352, 100=0.2016, 500=0.1512, 1000=0.12768, 5000=0.11424, 10000=0.10752, 25000=0.1008 (USD); Packaging: Bulk; Tolerance: ±20%; Operating Temperature: -55°C ~ 105°C; Features: General Purpose; ESR (Equivalent Series Resistance): -; Mounting Type: Through Hole; Package / Case: Radial, Can; Size / Dimension: 0.315" Dia (8.00mm); Height - Seated (Max): 0.453" (11.50mm); Lead Spacing: 0.138" (3.50mm); Surface Mount Land Size: -; ComponentLink1URL: http://industrial.panasonic.com/www-cgi/jvcr13pz.cgi?E+PZ+3+ABA0022+EEUFC0J471+7+WW; ComponentLink1Description: http://industrial.panasonic.com/www-cgi/jvcr13pz.cgi?E+PZ+3+ABA0022+EEUFC0J471+7+WW
CN2 = JST_PA_RA_TH_GUIDE_4POS: CONN HEADER PA 4POS SIDE 2MM TIN; Manufacturer: JST Sales America Inc.; Manufacturer Part Number: S04B-PASK-2(LF)(SN); Connector Type: Header, Shrouded; Number of Positions: 4; Number of Positions Loaded: All; Pitch: 0.079" (2.00mm); Supplier 1: Digi-Key; Packaging: Bulk; Contact Type: Male Pin; Contact Mating Length: 0.126" (3.20mm); Mounting Type: Through Hole, Right Angle; Termination: Kinked Pin, Solder; Fastening Type: Locking Ramp; Features: Board Guide; Contact Finish: Tin; ComponentLink1URL: http://www.jst-mfg.com/product/pdf/eng/ePA-F.pdf; ComponentLink1Description: http://www.jst-mfg.com/product/pdf/eng/ePA-F.pdf
CN3 = JST_PA_RA_TH_GUIDE_2POS: CONN HEADER PA 2POS SIDE 2MM TIN; Manufacturer: JST Sales America Inc.; Manufacturer Part Number: S02B-PASK-2(LF)(SN); Connector Type: Header, Shrouded; Number of Positions: 2; Number of Positions Loaded: All; Pitch: 0.079" (2.00mm); Supplier 1: Digi-Key; Packaging: Bulk; Contact Type: Male Pin; Contact Mating Length: 0.126" (3.20mm); Mounting Type: Through Hole, Right Angle; Termination: Kinked Pin, Solder; Fastening Type: Locking Ramp; Features: Board Guide; Contact Finish: Tin; ComponentLink1URL: http://www.jst-mfg.com/product/pdf/eng/ePA-F.pdf; ComponentLink1Description: http://www.jst-mfg.com/product/pdf/eng/ePA-F.pdf
D6 = DIODE_ES1B-FDICT-ND: DIODE SUPER FAST 100V 1A SMA; Manufacturer: Diodes Inc; Manufacturer Part Number: ES1B-13-F; Diode Type: Standard; Voltage - Forward (Vf) (Max) @ If: 920mV @ 1A; Speed: Fast Recovery =< 500ns, > 200mA (Io); Reverse Recovery Time (trr): 25ns; Current - Reverse Leakage @ Vr: 5µA @ 100V; Capacitance @ Vr, F: 10pF @ 4V, 1MHz; Supplier 1: Digi-Key; RoHS: RoHS Compliant; Category: Discrete Semiconductor Products; Packaging: Cut Tape (CT); Mounting Type: Surface Mount; Package / Case: DO-214AC, SMA; Supplier Device Package: SMA; ComponentLink1URL: http://www.diodes.com/datasheets/ds14001.pdf; ComponentLink1Description: http://www.diodes.com/datasheets/ds14001.pdf
D7 = LED_0603_GREEN_LG_LTST-C190GKT: as D5 on sheet Gas_Sampler-GPS; Supplier 1: Digi-Key; Manufacturer Part Number: LTST-C190GKT; Lens Type: Clear; Package / Case: 0603 (1608 Metric); Size / Dimension: 1.60mm L x 0.80mm W; Height: 0.80mm; Mounting Type: Surface Mount; Packaging: Cut Tape (CT); ComponentLink1URL: http://media.digikey.com/pdf/Data%20Sheets/Lite-On%20PDFs/LTST-C190GKT.pdf; ComponentLink1Description: Datasheet
FB2 = FERRITE_BEAD_0603_1.3A_600_OHM: FERRITE BEAD 600 OHM 0603 1LN; Manufacturer: Murata Electronics North America; Manufacturer Part Number: BLM18KG601SN1D; Filter Type: Power Line; Number of Lines: 1; Impedance @ Frequency: 600 Ohm @ 100MHz; DC Resistance (DCR) (Max): 150 mOhm; Supplier 1: Digi-Key; RoHS: RoHS Compliant; Category: Filters; Stock 1: 300163; Packaging: Cut Tape (CT); Operating Temperature: -55°C ~ 125°C; Package / Case: 0603 (1608 Metric); Mounting Type: Surface Mount; Height (Max): 0.037" (0.95mm); Size / Dimension: 0.063" L x 0.032" W (1.60mm x 0.80mm); ComponentLink1URL: http://media.digikey.com/pdf/Data%20Sheets/Murata%20PDFs/BLM18yyyyyyN1x.pdf; ComponentLink1Description: http://media.digikey.com/pdf/Data%20Sheets/Murata%20PDFs/BLM18yyyyyyN1x.pdf
R17 = RES_0603_470_OHM_1/10W_1%: as R16 on sheet Gas_Sampler-GPS; Supplier 1: Digi-Key; RoHS: RoHS Compliant; Category: Resistors; Stock 1: 212428; Pricing 1: 1=0.1, 50=0.0138, 100=0.0105, 250=0.0078, 500=0.00576, 1000=0.00384 (USD); Packaging: Cut Tape (CT); Composition: Thick Film; Features: -; Tolerance: ±1%; Package / Case: 0603 (1608 Metric); Supplier Device Package: 0603; Size / Dimension: 0.063" L x 0.031" W (1.60mm x 0.80mm); Height: 0.022" (0.55mm); Number of Terminations: 2; ComponentLink1URL: http://industrial.panasonic.com/www-cgi/jvcr13pz.cgi?E+PZ+3+AOA0002+ERJ3EKF4700V+7+WW; ComponentLink1Description: http://industrial.panasonic.com/www-cgi/jvcr13pz.cgi?E+PZ+3+AOA0002+ERJ3EKF4700V+7+WW
R18 = RES_0603_100K_OHM_1/10W_1%: RES 100K OHM 1/10W 1% 0603 SMD; Manufacturer: Panasonic Electronic Components; Manufacturer Part Number: ERJ-3EKF1003V; Power (Watts): 0.1W, 1/10W; Temperature Coefficient: ±100ppm/°C; Supplier 1: Digi-Key; RoHS: RoHS Compliant; Packaging: Cut Tape (CT); Composition: Thick Film; Features: -; Tolerance: ±1%; Package / Case: 0603 (1608 Metric); Supplier Device Package: 0603; Size / Dimension: 0.063" L x 0.031" W (1.60mm x 0.80mm); Height: 0.022" (0.55mm); Number of Terminations: 2; ComponentLink1URL: http://industrial.panasonic.com/www-cgi/jvcr13pz.cgi?E+PZ+3+AOA0002+ERJ3EKF1003V+7+WW; ComponentLink1Description: http://industrial.panasonic.com/www-cgi/jvcr13pz.cgi?E+PZ+3+AOA0002+ERJ3EKF1003V+7+WW
TP5 = TEST_KEYSTONE5001: as TP11 on sheet Gas_Sampler-Top; Supplier 1: Digi-Key; Supplier Part Number 1: 5001K-ND; RoHS: RoHS Compliant; Category: Test and Measurement; Stock 1: 341830; Pricing 1: 1=0.33, 10=0.309, 50=0.2252, 100=0.2164, 250=0.19432, 500=0.18548, 1000=0.15456, 2500=0.14131, 5000=0.13248 (USD); Packaging: Bulk; Type: PC Test Point, Miniature; Terminal: 0.010" x 0.020" (0.25mm x 0.51mm) Phosphor Bronze Wire, Silver Plate; Mounting Type: 0.040" (1.02mm) Hole Diameter; Material: Base, Nylon 46, UL 94V-0; Color: Black; ComponentLink1URL: http://www.keyelco.com/product-pdf.cfm?p=1310; ComponentLink1Description: http://www.keyelco.com/product-pdf.cfm?p=1310
U8 = LOW_SW_BTS3125EJXUMA1: IC PWR SWITCH N-CHAN 1:1 TDSO-8; Manufacturer: Infineon Technologies; Voltage - Load: 31V Max; Output Configuration: Low Side; Supplier 1: Digi-Key; Manufacturer Part Number: BTS3125EJXUMA1; Packaging: Cut Tape (CT); Operating Temperature: -40°C ~ 150°C (TJ); Package / Case: 8-SOIC (0.154", 3.90mm Width) Exposed Pad; Supplier Device Package: PG-TDSO-8-31; ComponentLink1URL: https://www.infineon.com/dgdl/Infineon-BTS3125EJ-DS-v01_00-EN.pdf; ComponentLink1Description: Datasheet

## Sheet Gas_Sampler-Flow_Sensor.SchDoc: Flow Sensor
size Tabloid; Organization: Sensible Robotics LLC; Address1: 120 E Church Ave Suite B; Address2: Ridgecrest CA, 93555; Revision: 0; SheetNumber: 12; SheetTotal: 12; ApprovedBy: Approved Name; Engineer: Mike Licitra; PageSetup: Record=PageOptions|CenterHorizontal=True|CenterVertical=True|PrintScale=0.98|XCorrection=1.00|YCorrection=1.00|PrintKind=0|BorderSize=5000000|LeftOffset=0|BottomOffset=0|Orientation=2|PaperLength=1000|PaperWidth=1000|Scale=100|PaperSource=15|PrintQuality=600|MediaType=1|DitherType=10|PaperKind=Tabloid|PrintScaleMode=1
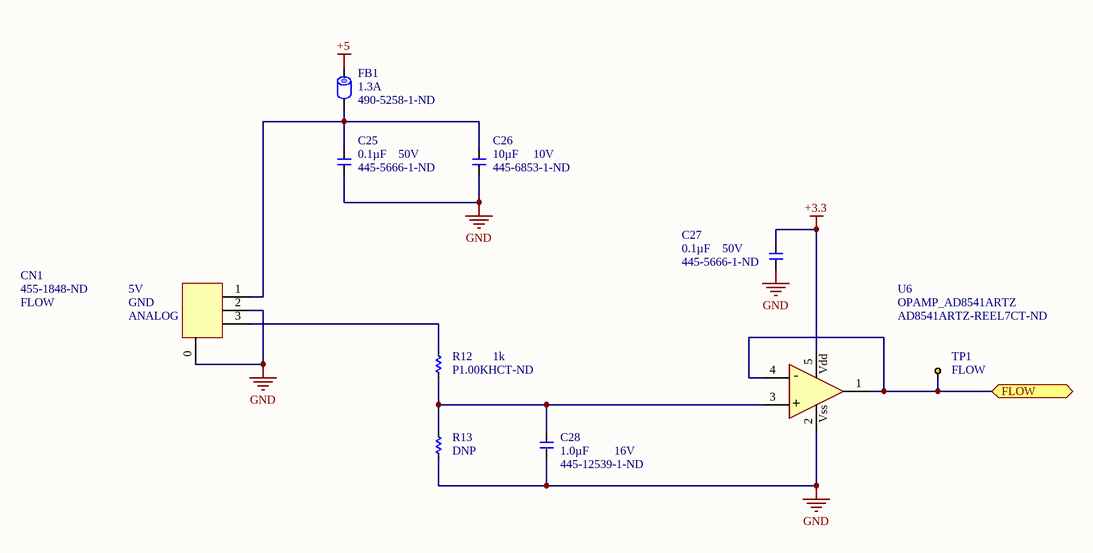
[diagram p6: Gas_Sampler-Flow_Sensor.SchDoc]

### Parts
C25  value 0.1µF  Voltage - Rated: 50V  Supplier Part Number 1: 445-5666-1-ND  [C0603]  (hidden comment: CAP_CER_0603_0.1UF_50V_10%_X7R)
C26  value 10µF  Voltage - Rated: 10V  Supplier Part Number 1: 445-6853-1-ND  [C0603]  (hidden comment: CAP_CER_0603_10UF_10V_20%_X5R)
C27  value 0.1µF  Voltage - Rated: 50V  Supplier Part Number 1: 445-5666-1-ND  [C0603]  (hidden comment: CAP_CER_0603_0.1UF_50V_10%_X7R)
C28  value 1.0µF  Supplier Part Number 1: 445-12539-1-ND  Voltage - Rated: 16V  [C0603]  (hidden comment: CAP_CER_0603_1UF_16V_10%_X7R)
CN1  FLOW  Supplier Part Number 1: 455-1848-ND  [JST_PA_S03B-PASK-2]
FB1  Current Rating (Max): 1.3A  Supplier Part Number 1: 490-5258-1-ND  [R0603]  (hidden comment: FERRITE_BEAD_0603_1.3A_600_OHM)
R12  value 1k  Supplier Part Number 1: P1.00KHCT-ND  [R0603]  (hidden comment: RES_0603_1K_OHM_1/10W_1%)
R13  value DNP  [R0603]  (hidden comment: RES_0603_DNP)  (no BOM)
TP1  FLOW  [TP_KEYSTONE_5001]
U6  OPAMP_AD8541ARTZ  Supplier Part Number 1: AD8541ARTZ-REEL7CT-ND  [5SOT23]

### Ports
FLOW

### Nets
+3.3: C27.1 U6.5(VDD)
+5: FB1.1
GND: C25.2 C26.2 C27.2 C28.2 CN1.0(CHAS) CN1.2 R13.1 U6.2(VSS)
FLOW_SENSE: TP1.1 U6.1(OUT) U6.4(IN-) ; port FLOW
NetC25_1: C25.1 C26.1 CN1.1 FB1.2
NetC28_1: C28.1 R12.1 R13.2 U6.3(IN+)
NetCN1_3: CN1.3 R12.2

### Notes on the sheet
- 5V
- (near CN1) GND
- (near CN1) ANALOG
- CONFIDENTIAL DOCUMENT
- DUPLICATION PROHIBITED
- ENGINEER
- PCB FAB #
- SCH #
- REV
- Sensible
- Robotics
- THIS DOCUMENT CONTAINS INFORMATION AND OR DATA, WHICH IS PROPRIETARY AND CONFIDENTIAL TO SENSIBLE ROBOTICS LLC.  THIS INFORMATION AND OR DATA, IS TO BE USED ONLY FOR THE BENEFIT OF THE SUPPLIER, AND IS NOT TO BE USED FOR THE BENEFIT OF OTHER PARTIES WITHOUT WRITTEN CONSENT.
- DATE
- PCB ASSY #
- SIZE
- Tabloid
- SHEET
- OF
- FILE
- (in symbol OPAMP_AD8541ARTZ) Vdd; +; Vss

### Library data of the parts
C25 C27 = CAP_CER_0603_0.1UF_50V_10%_X7R: as C29 on sheet Gas_Sampler-Motor; Supplier 1: Digi-Key; RoHS: RoHS Compliant; Category: Capacitors; Stock 1: 320000; Pricing 1: 1=0.1, 10=0.072, 100=0.033, 250=0.027, 500=0.0231, 1000=0.018 (USD); Packaging: Cut Tape (CT); Tolerance: ±10%; Temperature Coefficient: X7R; Mounting Type: Surface Mount, MLCC; Operating Temperature: -55°C ~ 125°C; Applications: Automotive; Ratings: AEC-Q200; Package / Case: 0603 (1608 Metric); Size / Dimension: 0.063" L x 0.031" W (1.60mm x 0.80mm); Height - Seated (Max): -; Thickness (Max): 0.035" (0.90mm); Lead Spacing: -; Features: -; Lead Style: -; ComponentLink1URL: http://product.tdk.com/capacitor/mlcc/en/documents/mlcc_automotive_general_en.pdf; ComponentLink1Description: http://product.tdk.com/capacitor/mlcc/en/documents/mlcc_automotive_general_en.pdf
C26 = CAP_CER_0603_10UF_10V_20%_X5R: CAP CER 10UF 10V X5R 0603; Manufacturer: TDK Corporation; Manufacturer Part Number: C1608X5R1A106M080AC; Tolerance: ±20%; Supplier 1: Digi-Key; RoHS: RoHS Compliant; Packaging: Cut Tape (CT); Part Status: Active; Temperature Coefficient: X5R; Operating Temperature: -55°C ~ 85°C; Features: Low ESL; Applications: General Purpose; Mounting Type: Surface Mount, MLCC; Package / Case: 0603 (1608 Metric); Size / Dimension: 0.063" L x 0.032" W (1.60mm x 0.80mm); Thickness (Max): 0.035" (0.90mm); ComponentLink1URL: https://product.tdk.com/info/en/catalog/datasheets/mlcc_commercial_general_en.pdf; ComponentLink1Description: https://product.tdk.com/info/en/catalog/datasheets/mlcc_commercial_general_en.pdf
C28 = CAP_CER_0603_1UF_16V_10%_X7R: CAP CER 1UF 16V 10% X7R 0603; Manufacturer: TDK Corporation; Manufacturer Part Number: CGA3E1X7R1C105K080AC; Supplier 1: Digi-Key; RoHS: RoHS Compliant; Packaging: Cut Tape (CT); Tolerance: ±10%; Temperature Coefficient: X7R; Mounting Type: Surface Mount, MLCC; Operating Temperature: -55°C ~ 125°C; Applications: Automotive; Ratings: AEC-Q200; Package / Case: 0603 (1608 Metric); Size / Dimension: 0.063" L x 0.031" W (1.60mm x 0.80mm); Thickness (Max): 0.035" (0.90mm); ComponentLink1URL: http://product.tdk.com/capacitor/mlcc/en/documents/mlcc_automotive_general_en.pdf; ComponentLink1Description: http://product.tdk.com/capacitor/mlcc/en/documents/mlcc_automotive_general_en.pdf
CN1 = JST_PA_RA_TH_GUIDE_3POS: CONN HEADER PA 3POS SIDE 2MM TIN; Manufacturer: JST Sales America Inc.; Manufacturer Part Number: S03B-PASK-2(LF)(SN); Connector Type: Header, Shrouded; Number of Positions: 3; Number of Positions Loaded: All; Pitch: 0.079" (2.00mm); Supplier 1: Digi-Key; Packaging: Bulk; Contact Type: Male Pin; Contact Mating Length: 0.126" (3.20mm); Mounting Type: Through Hole, Right Angle; Termination: Kinked Pin, Solder; Fastening Type: Locking Ramp; Features: Board Guide; ComponentLink1URL: http://www.jst-mfg.com/product/pdf/eng/ePA-F.pdf; ComponentLink1Description: http://www.jst-mfg.com/product/pdf/eng/ePA-F.pdf
FB1 = FERRITE_BEAD_0603_1.3A_600_OHM: as FB2 on sheet Gas_Sampler-Motor; Supplier 1: Digi-Key; RoHS: RoHS Compliant; Category: Filters; Stock 1: 300163; Packaging: Cut Tape (CT); Operating Temperature: -55°C ~ 125°C; Package / Case: 0603 (1608 Metric); Mounting Type: Surface Mount; Height (Max): 0.037" (0.95mm); Size / Dimension: 0.063" L x 0.032" W (1.60mm x 0.80mm); ComponentLink1URL: http://media.digikey.com/pdf/Data%20Sheets/Murata%20PDFs/BLM18yyyyyyN1x.pdf; ComponentLink1Description: http://media.digikey.com/pdf/Data%20Sheets/Murata%20PDFs/BLM18yyyyyyN1x.pdf
R12 = RES_0603_1K_OHM_1/10W_1%: RES 1K OHM 1/10W 1% 0603 SMD; Manufacturer: Panasonic Electronic Components; Manufacturer Part Number: ERJ-3EKF1001V; Power (Watts): 0.1W, 1/10W; Temperature Coefficient: ±100ppm/°C; Supplier 1: Digi-Key; RoHS: RoHS Compliant; Packaging: Cut Tape (CT); Composition: Thick Film; Features: -; Tolerance: ±1%; Package / Case: 0603 (1608 Metric); Supplier Device Package: 0603; Size / Dimension: 0.063" L x 0.031" W (1.60mm x 0.80mm); Height: 0.022" (0.55mm); Number of Terminations: 2; ComponentLink1URL: http://industrial.panasonic.com/www-cgi/jvcr13pz.cgi?E+PZ+3+AOA0002+ERJ3EKF1001V+7+WW; ComponentLink1Description: http://industrial.panasonic.com/www-cgi/jvcr13pz.cgi?E+PZ+3+AOA0002+ERJ3EKF1001V+7+WW
R13 = RES_0603_DNP: as R11 on sheet Gas_Sampler-BME_280; Supplier 1: Digi-Key; Supplier Part Number 1: DNP
TP1 = TEST_KEYSTONE5001: as TP11 on sheet Gas_Sampler-Top; Supplier 1: Digi-Key; Supplier Part Number 1: 5001K-ND; RoHS: RoHS Compliant; Category: Test and Measurement; Stock 1: 341830; Pricing 1: 1=0.33, 10=0.309, 50=0.2252, 100=0.2164, 250=0.19432, 500=0.18548, 1000=0.15456, 2500=0.14131, 5000=0.13248 (USD); Packaging: Bulk; Type: PC Test Point, Miniature; Terminal: 0.010" x 0.020" (0.25mm x 0.51mm) Phosphor Bronze Wire, Silver Plate; Mounting Type: 0.040" (1.02mm) Hole Diameter; Material: Base, Nylon 46, UL 94V-0; Color: Black; ComponentLink1URL: http://www.keyelco.com/product-pdf.cfm?p=1310; ComponentLink1Description: http://www.keyelco.com/product-pdf.cfm?p=1310
U6 = OPAMP_AD8541ARTZ: IC OPAMP GP R-R CMOS SOT23-5; Manufacturer: Analog Devices Inc; Manufacturer Part Number: AD8541ARTZ-REEL7; Part Number: 480-00120-00; Amplifier Type: General Purpose; Number of Circuits: 1; Output Type: Rail-to-Rail; Slew Rate: 0.92 V/µs; Gain Bandwidth Product: 1MHz; Current - Input Bias: 4pA; Voltage - Input Offset: 1mV; Current - Supply: 45µA; Current - Output / Channel: 30mA; Voltage - Supply, Single/Dual (±): 2.7 V ~ 5.5 V; Supplier 1: Digi-Key; RoHS: RoHS Compliant; Category: Integrated Circuits (ICs); Stock 1: 26612; Pricing 1: 1=0.85, 10=0.747, 25=0.6604, 100=0.5755, 250=0.50096, 500=0.42642, 1000=0.34155 (USD); Packaging: Cut Tape (CT); -3db Bandwidth: -; Operating Temperature: -40°C ~ 125°C; Mounting Type: Surface Mount; Package / Case: SC-74A, SOT-753; Supplier Device Package: SOT-23-5; ComponentLink1URL: http://www.analog.com/static/imported-files/data_sheets/AD8541_8542_8544.pdf; ComponentLink1Description: http://www.analog.com/static/imported-files/data_sheets/AD8541_8542_8544.pdf